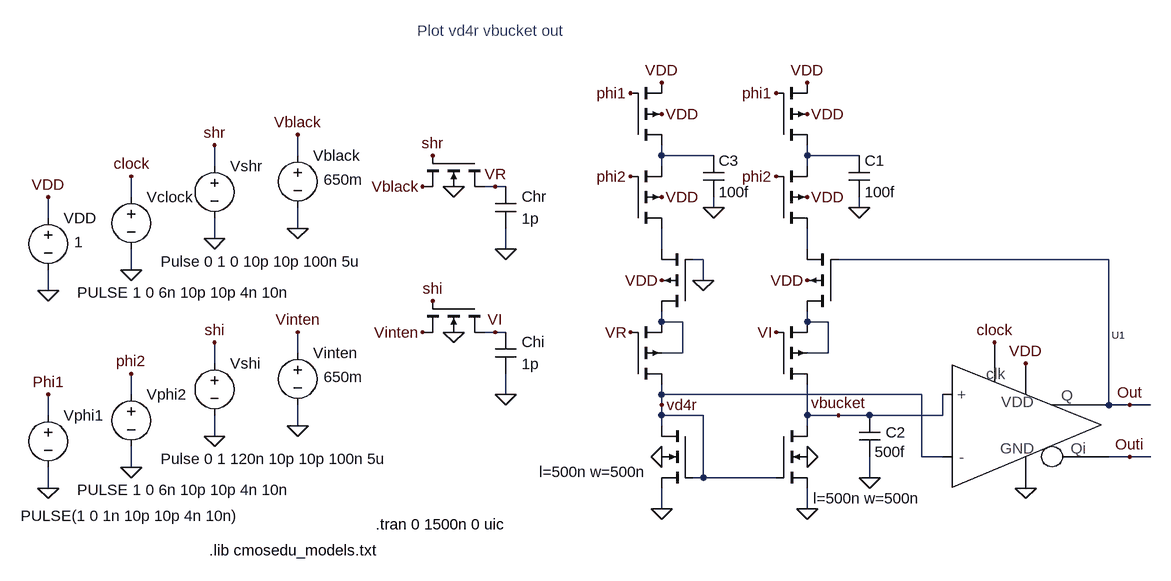
[diagram p0: schematic Fig17_34a.asc]
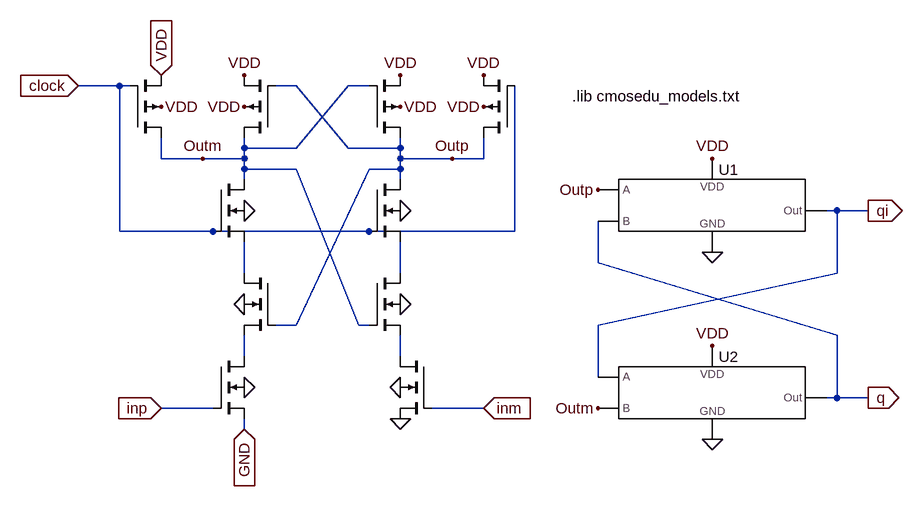
[diagram p1: sub-circuit fig_17_16_no_vos.asc]
Fig17_34a.asc, the LTspice schematic file:
Version 4
SHEET 1 1836 680
WIRE 80 -448 80 -480
WIRE 80 -336 80 -368
WIRE 80 -144 80 -176
WIRE 80 -32 80 -64
WIRE 208 -480 208 -512
WIRE 208 -368 208 -400
WIRE 208 -176 208 -208
WIRE 208 -64 208 -96
WIRE 336 -528 336 -560
WIRE 336 -416 336 -448
WIRE 336 -224 336 -256
WIRE 336 -112 336 -144
WIRE 464 -544 464 -576
WIRE 464 -432 464 -464
WIRE 464 -240 464 -272
WIRE 464 -128 464 -160
WIRE 768 -496 752 -496
WIRE 768 -272 752 -272
WIRE 784 -496 768 -496
WIRE 784 -400 784 -432
WIRE 784 -272 768 -272
WIRE 784 -176 784 -208
WIRE 1024 -544 1024 -560
WIRE 1024 -528 1024 -544
WIRE 1024 -400 1024 -432
WIRE 1024 -288 1024 -304
WIRE 1024 -176 1024 -192
WIRE 1024 -160 1024 -176
WIRE 1024 -144 1024 -160
WIRE 1024 -128 1024 -144
WIRE 1024 0 1024 -32
WIRE 1056 -288 1024 -288
WIRE 1056 -240 1024 -240
WIRE 1056 -240 1056 -288
WIRE 1088 -384 1072 -384
WIRE 1088 -352 1088 -384
WIRE 1088 -144 1024 -144
WIRE 1088 -48 1072 -48
WIRE 1088 -48 1088 -144
WIRE 1104 -544 1024 -544
WIRE 1104 -464 1104 -480
WIRE 1200 -48 1088 -48
WIRE 1248 -544 1248 -560
WIRE 1248 -528 1248 -544
WIRE 1248 -400 1248 -432
WIRE 1248 -288 1248 -304
WIRE 1248 -144 1248 -192
WIRE 1248 -128 1248 -144
WIRE 1248 0 1248 -32
WIRE 1280 -288 1248 -288
WIRE 1280 -240 1248 -240
WIRE 1280 -240 1280 -288
WIRE 1296 -144 1248 -144
WIRE 1328 -544 1248 -544
WIRE 1328 -464 1328 -480
WIRE 1344 -144 1296 -144
WIRE 1344 -48 1344 -80
WIRE 1424 -176 1024 -176
WIRE 1424 -80 1424 -176
WIRE 1456 -144 1344 -144
WIRE 1456 -144 1456 -176
WIRE 1456 -80 1424 -80
WIRE 1712 -384 1296 -384
WIRE 1712 -160 1712 -384
WIRE 1744 -160 1712 -160
WIRE 1744 -80 1712 -80
WIRE 1776 -160 1744 -160
WIRE 1776 -80 1744 -80
FLAG 80 -336 0
FLAG 80 -480 VDD
FLAG 1248 -608 VDD
FLAG 1248 -656 VDD
FLAG 80 -32 0
FLAG 80 -176 Phi1
FLAG 208 -64 0
FLAG 208 -208 phi2
FLAG 1248 -480 VDD
FLAG 1248 -352 VDD
FLAG 1200 -640 phi1
FLAG 1200 -512 phi2
FLAG 1328 -464 0
FLAG 1584 -224 VDD
FLAG 208 -368 0
FLAG 208 -512 clock
FLAG 1536 -256 clock
FLAG 1584 -32 0
FLAG 1744 -160 Out
FLAG 1744 -80 Outi
FLAG 1248 -80 0
FLAG 1248 0 0
FLAG 1344 -48 0
FLAG 1024 -80 0
FLAG 1024 0 0
FLAG 1296 -144 vbucket
FLAG 1024 -160 vd4r
FLAG 1024 -608 VDD
FLAG 1024 -656 VDD
FLAG 1024 -480 VDD
FLAG 1024 -352 VDD
FLAG 976 -640 phi1
FLAG 976 -512 phi2
FLAG 1104 -464 0
FLAG 976 -272 VR
FLAG 1200 -272 VI
FLAG 336 -416 0
FLAG 336 -560 shr
FLAG 336 -112 0
FLAG 336 -256 shi
FLAG 464 -432 0
FLAG 464 -576 Vblack
FLAG 464 -128 0
FLAG 464 -272 Vinten
FLAG 784 -400 0
FLAG 704 -496 0
FLAG 656 -496 Vblack
FLAG 672 -544 shr
FLAG 768 -496 VR
FLAG 784 -176 0
FLAG 704 -272 0
FLAG 656 -272 Vinten
FLAG 672 -320 shi
FLAG 768 -272 VI
FLAG 1088 -352 0
SYMBOL voltage 80 -464 R0
WINDOW 123 0 0 Left 0
WINDOW 39 0 0 Left 0
WINDOW 3 40 53 Left 0
SYMATTR Value 1
SYMATTR InstName VDD
SYMBOL pmos4 1200 -560 M180
WINDOW 0 56 32 Invisible 0
WINDOW 3 56 72 Invisible 0
SYMATTR InstName M3
SYMATTR Value P_50n
SYMATTR Value2 l=50n w=1u
SYMBOL voltage 80 -160 R0
WINDOW 123 0 0 Left 0
WINDOW 39 0 0 Left 0
WINDOW 3 -42 171 Left 0
SYMATTR Value PULSE(1 0 1n 10p 10p 4n 10n)
SYMATTR InstName Vphi1
SYMBOL voltage 208 -192 R0
WINDOW 123 0 0 Left 0
WINDOW 39 0 0 Left 0
WINDOW 3 -83 163 Left 0
SYMATTR Value PULSE 1 0 6n 10p 10p 4n 10n
SYMATTR InstName Vphi2
SYMBOL pmos4 1200 -432 M180
WINDOW 0 56 32 Invisible 0
WINDOW 3 56 72 Invisible 0
SYMATTR InstName M1
SYMATTR Value P_50n
SYMATTR Value2 l=50n w=1u
SYMBOL pmos4 1296 -304 R180
WINDOW 0 56 32 Invisible 0
WINDOW 3 56 72 Invisible 0
SYMATTR InstName M2
SYMATTR Value P_50n
SYMATTR Value2 l=50n w=1u
SYMBOL cap 1312 -544 R0
SYMATTR InstName C1
SYMATTR Value 100f
SYMBOL pmos4 1200 -192 M180
WINDOW 0 56 32 Invisible 0
WINDOW 3 56 72 Invisible 0
SYMATTR InstName M4
SYMATTR Value P_50n
SYMATTR Value2 l=50n w=1u
SYMBOL voltage 208 -496 R0
WINDOW 123 0 0 Left 0
WINDOW 39 0 0 Left 0
WINDOW 3 -83 163 Left 0
SYMATTR Value PULSE 1 0 6n 10p 10p 4n 10n
SYMATTR InstName Vclock
SYMBOL Fig_17_16_no_Vos 1504 -128 R0
SYMATTR InstName U1
SYMBOL nmos4 1200 -128 R0
WINDOW 0 56 32 Invisible 0
WINDOW 3 56 72 Invisible 0
WINDOW 123 57 112 Left 0
SYMATTR InstName M5
SYMATTR Value N_50n
SYMATTR Value2 l=500n w=500n
SYMBOL cap 1328 -144 R0
WINDOW 0 41 26 Left 0
SYMATTR InstName C2
SYMATTR Value 500f
SYMBOL nmos4 1072 -128 M0
WINDOW 0 56 32 Invisible 0
WINDOW 3 56 72 Invisible 0
WINDOW 123 71 71 Left 0
SYMATTR InstName M6
SYMATTR Value N_50n
SYMATTR Value2 l=500n w=500n
SYMBOL pmos4 976 -560 M180
WINDOW 0 56 32 Invisible 0
WINDOW 3 56 72 Invisible 0
SYMATTR InstName M7
SYMATTR Value P_50n
SYMATTR Value2 l=50n w=1u
SYMBOL pmos4 976 -432 M180
WINDOW 0 56 32 Invisible 0
WINDOW 3 56 72 Invisible 0
SYMATTR InstName M8
SYMATTR Value P_50n
SYMATTR Value2 l=50n w=1u
SYMBOL pmos4 1072 -304 R180
WINDOW 0 56 32 Invisible 0
WINDOW 3 56 72 Invisible 0
SYMATTR InstName M9
SYMATTR Value P_50n
SYMATTR Value2 l=50n w=1u
SYMBOL cap 1088 -544 R0
SYMATTR InstName C3
SYMATTR Value 100f
SYMBOL pmos4 976 -192 M180
WINDOW 0 56 32 Invisible 0
WINDOW 3 56 72 Invisible 0
SYMATTR InstName M10
SYMATTR Value P_50n
SYMATTR Value2 l=50n w=1u
SYMBOL voltage 336 -544 R0
WINDOW 123 0 0 Left 0
WINDOW 39 0 0 Left 0
WINDOW 3 -83 163 Left 0
SYMATTR Value Pulse 0 1 0 10p 10p 100n 5u
SYMATTR InstName Vshr
SYMBOL voltage 336 -240 R0
WINDOW 123 0 0 Left 0
WINDOW 39 0 0 Left 0
WINDOW 3 -83 163 Left 0
SYMATTR Value Pulse 0 1 120n 10p 10p 100n 5u
SYMATTR InstName Vshi
SYMBOL voltage 464 -560 R0
WINDOW 123 0 0 Left 0
WINDOW 39 0 0 Left 0
WINDOW 3 40 53 Left 0
SYMATTR Value 650m
SYMATTR InstName Vblack
SYMBOL voltage 464 -256 R0
WINDOW 123 0 0 Left 0
WINDOW 39 0 0 Left 0
WINDOW 3 40 53 Left 0
SYMATTR Value 650m
SYMATTR InstName Vinten
SYMBOL cap 768 -496 R0
WINDOW 0 41 15 Left 0
WINDOW 3 41 49 Left 0
SYMATTR InstName Chr
SYMATTR Value 1p
SYMBOL nmos4 752 -544 R90
WINDOW 0 56 32 Invisible 0
WINDOW 3 56 72 Invisible 0
SYMATTR InstName M11
SYMATTR Value N_50n
SYMATTR Value2 l=50n w=500n
SYMBOL cap 768 -272 R0
WINDOW 0 41 15 Left 0
WINDOW 3 41 49 Left 0
SYMATTR InstName Chi
SYMATTR Value 1p
SYMBOL nmos4 752 -320 R90
WINDOW 0 56 32 Invisible 0
WINDOW 3 56 72 Invisible 0
SYMATTR InstName M12
SYMATTR Value N_50n
SYMATTR Value2 l=50n w=500n
TEXT 328 64 Left 0 !.lib cmosedu_models.txt
TEXT 584 24 Left 0 !.tran 0 1500n 0 uic
TEXT 648 -736 Left 0 ;Plot vd4r vbucket out

fig_17_16_no_vos.asc, the sub-circuit schematic file:
Version 4
SHEET 1 1760 680
WIRE 528 -560 464 -560
WIRE 528 -336 528 -560
WIRE 544 -560 528 -560
WIRE 592 -448 592 -480
WIRE 656 -448 592 -448
WIRE 672 -336 528 -336
WIRE 672 -64 592 -64
WIRE 720 -464 720 -480
WIRE 720 -448 656 -448
WIRE 720 -448 720 -464
WIRE 720 -432 720 -448
WIRE 720 -416 720 -432
WIRE 720 -272 720 -320
WIRE 720 -144 720 -176
WIRE 720 -32 720 -48
WIRE 800 -560 768 -560
WIRE 800 -464 720 -464
WIRE 800 -432 720 -432
WIRE 800 -192 768 -192
WIRE 880 -560 800 -464
WIRE 880 -464 800 -560
WIRE 896 -192 800 -432
WIRE 912 -560 880 -560
WIRE 912 -432 800 -192
WIRE 912 -336 672 -336
WIRE 912 -192 896 -192
WIRE 960 -464 880 -464
WIRE 960 -464 960 -480
WIRE 960 -448 960 -464
WIRE 960 -432 912 -432
WIRE 960 -432 960 -448
WIRE 960 -416 960 -432
WIRE 960 -272 960 -320
WIRE 960 -144 960 -176
WIRE 1040 -448 960 -448
WIRE 1088 -448 1040 -448
WIRE 1088 -448 1088 -480
WIRE 1088 -64 1008 -64
WIRE 1136 -336 912 -336
WIRE 1136 -336 1136 -560
WIRE 1264 -288 1264 -352
WIRE 1264 -112 1264 -192
WIRE 1632 -368 1616 -368
WIRE 1632 -272 1264 -192
WIRE 1632 -272 1632 -368
WIRE 1632 -176 1264 -288
WIRE 1632 -80 1616 -80
WIRE 1632 -80 1632 -176
WIRE 1680 -368 1632 -368
WIRE 1680 -80 1632 -80
FLAG 720 -96 0
FLAG 720 -528 VDD
FLAG 960 -528 VDD
FLAG 720 -576 VDD
FLAG 960 -576 VDD
FLAG 960 -224 0
FLAG 720 -224 0
FLAG 592 -528 VDD
FLAG 1088 -528 VDD
FLAG 1088 -576 VDD
FLAG 720 -368 0
FLAG 960 -368 0
FLAG 960 -96 0
FLAG 960 -48 0
FLAG 1040 -448 Outp
FLAG 656 -448 Outm
FLAG 1440 -304 0
FLAG 1440 -16 0
FLAG 1440 -448 VDD
FLAG 1440 -160 VDD
FLAG 1264 -400 Outp
FLAG 1264 -64 Outm
FLAG 592 -64 inp
IOPIN 592 -64 In
FLAG 1088 -64 inm
IOPIN 1088 -64 In
FLAG 464 -560 clock
IOPIN 464 -560 In
FLAG 1680 -368 qi
IOPIN 1680 -368 Out
FLAG 1680 -80 q
IOPIN 1680 -80 Out
FLAG 592 -576 VDD
IOPIN 592 -576 In
FLAG 720 -32 GND
IOPIN 720 -32 In
SYMBOL nmos4 672 -144 R0
WINDOW 0 104 24 Invisible 0
WINDOW 3 179 41 Invisible 0
SYMATTR InstName M1
SYMATTR Value N_50n
SYMATTR Value2 l=50n w=500n
SYMBOL pmos4 768 -480 R180
WINDOW 0 56 32 Invisible 0
WINDOW 3 56 72 Invisible 0
SYMATTR InstName M2
SYMATTR Value P_50n
SYMATTR Value2 l=50n w=1u
SYMBOL pmos4 912 -480 M180
WINDOW 0 56 32 Invisible 0
WINDOW 3 56 72 Invisible 0
SYMATTR InstName M3
SYMATTR Value P_50n
SYMATTR Value2 l=50n w=1u
SYMBOL nmos4 912 -272 R0
WINDOW 0 104 24 Invisible 0
WINDOW 3 179 41 Invisible 0
SYMATTR InstName M5
SYMATTR Value N_50n
SYMATTR Value2 l=50n w=500n
SYMBOL nmos4 768 -272 M0
WINDOW 0 104 24 Invisible 0
WINDOW 3 179 41 Invisible 0
SYMATTR InstName M6
SYMATTR Value N_50n
SYMATTR Value2 l=50n w=500n
SYMBOL pmos4 544 -480 M180
WINDOW 0 56 32 Invisible 0
WINDOW 3 56 72 Invisible 0
SYMATTR InstName M4
SYMATTR Value P_50n
SYMATTR Value2 l=50n w=1u
SYMBOL pmos4 1136 -480 R180
WINDOW 0 56 32 Invisible 0
WINDOW 3 56 72 Invisible 0
SYMATTR InstName M7
SYMATTR Value P_50n
SYMATTR Value2 l=50n w=1u
SYMBOL nmos4 672 -416 R0
WINDOW 0 104 24 Invisible 0
WINDOW 3 179 41 Invisible 0
SYMATTR InstName M8
SYMATTR Value N_50n
SYMATTR Value2 l=50n w=500n
SYMBOL nmos4 912 -416 R0
WINDOW 0 104 24 Invisible 0
WINDOW 3 179 41 Invisible 0
SYMATTR InstName M9
SYMATTR Value N_50n
SYMATTR Value2 l=50n w=500n
SYMBOL nmos4 1008 -144 M0
WINDOW 0 104 24 Invisible 0
WINDOW 3 179 41 Invisible 0
SYMATTR InstName M10
SYMATTR Value N_50n
SYMATTR Value2 l=50n w=500n
SYMBOL NAND_2 1216 -352 R0
SYMATTR InstName U1
SYMBOL NAND_2 1216 -64 R0
SYMATTR InstName U2
TEXT 1224 -544 Left 0 !.lib cmosedu_models.txt

The netlist it stands for:
* Fig17_34a.asc
VDD VDD 0 1
M3 N004 Phi1 VDD VDD P_50n l=50n w=1u
Vphi1 Phi1 0 PULSE(1 0 1n 10p 10p 4n 10n)
Vphi2 phi2 0 PULSE 1 0 6n 10p 10p 4n 10n
M1 N005 phi2 N004 VDD P_50n l=50n w=1u
M2 N006 Out N005 VDD P_50n l=50n w=1u
C1 N004 0 100f
M4 vbucket VI N006 N006 P_50n l=50n w=1u
Vclock clock 0 PULSE 1 0 6n 10p 10p 4n 10n
XU1 vbucket vd4r Out Outi clock VDD 0 fig_17_16_no_vos
M5 vbucket vd4r 0 0 N_50n l=500n w=500n
C2 vbucket 0 500f
M6 vd4r vd4r 0 0 N_50n l=500n w=500n
M7 N001 Phi1 VDD VDD P_50n l=50n w=1u
M8 N002 phi2 N001 VDD P_50n l=50n w=1u
M9 N003 0 N002 VDD P_50n l=50n w=1u
C3 N001 0 100f
M10 vd4r VR N003 N003 P_50n l=50n w=1u
Vshr shr 0 Pulse 0 1 0 10p 10p 100n 5u
Vshi shi 0 Pulse 0 1 120n 10p 10p 100n 5u
Vblack Vblack 0 650m
Vinten Vinten 0 650m
Chr VR 0 1p
M11 VR shr Vblack 0 N_50n l=50n w=500n
Chi VI 0 1p
M12 VI shi Vinten 0 N_50n l=50n w=500n

* block symbol definitions
.subckt fig_17_16_no_vos inp inm q qi clock VDD GND
M1 N002 inp GND 0 N_50n l=50n w=500n
M2 Outm Outp VDD VDD P_50n l=50n w=1u
M3 Outp Outm VDD VDD P_50n l=50n w=1u
M5 N003 Outm N004 0 N_50n l=50n w=500n
M6 N001 Outp N002 0 N_50n l=50n w=500n
M4 Outm clock VDD VDD P_50n l=50n w=1u
M7 Outp clock VDD VDD P_50n l=50n w=1u
M8 Outm clock N001 0 N_50n l=50n w=500n
M9 Outp clock N003 0 N_50n l=50n w=500n
M10 N004 inm 0 0 N_50n l=50n w=500n
XU1 Outp q qi VDD 0 NAND_2  ; pins A B Out VDD GND
XU2 qi Outm q VDD 0 NAND_2  ; pins A B Out VDD GND
.lib cmosedu_models.txt
.ends fig_17_16_no_vos

.model NMOS NMOS
.model PMOS PMOS
.lib standard.mos
.lib cmosedu_models.txt
.tran 0 1500n 0 uic
* Plot vd4r vbucket out
.backanno
.end